# Altium schematic sheet MicrocontrollerDigital.SchDoc
size A3; SheetNumber: 2; SheetTotal: 3
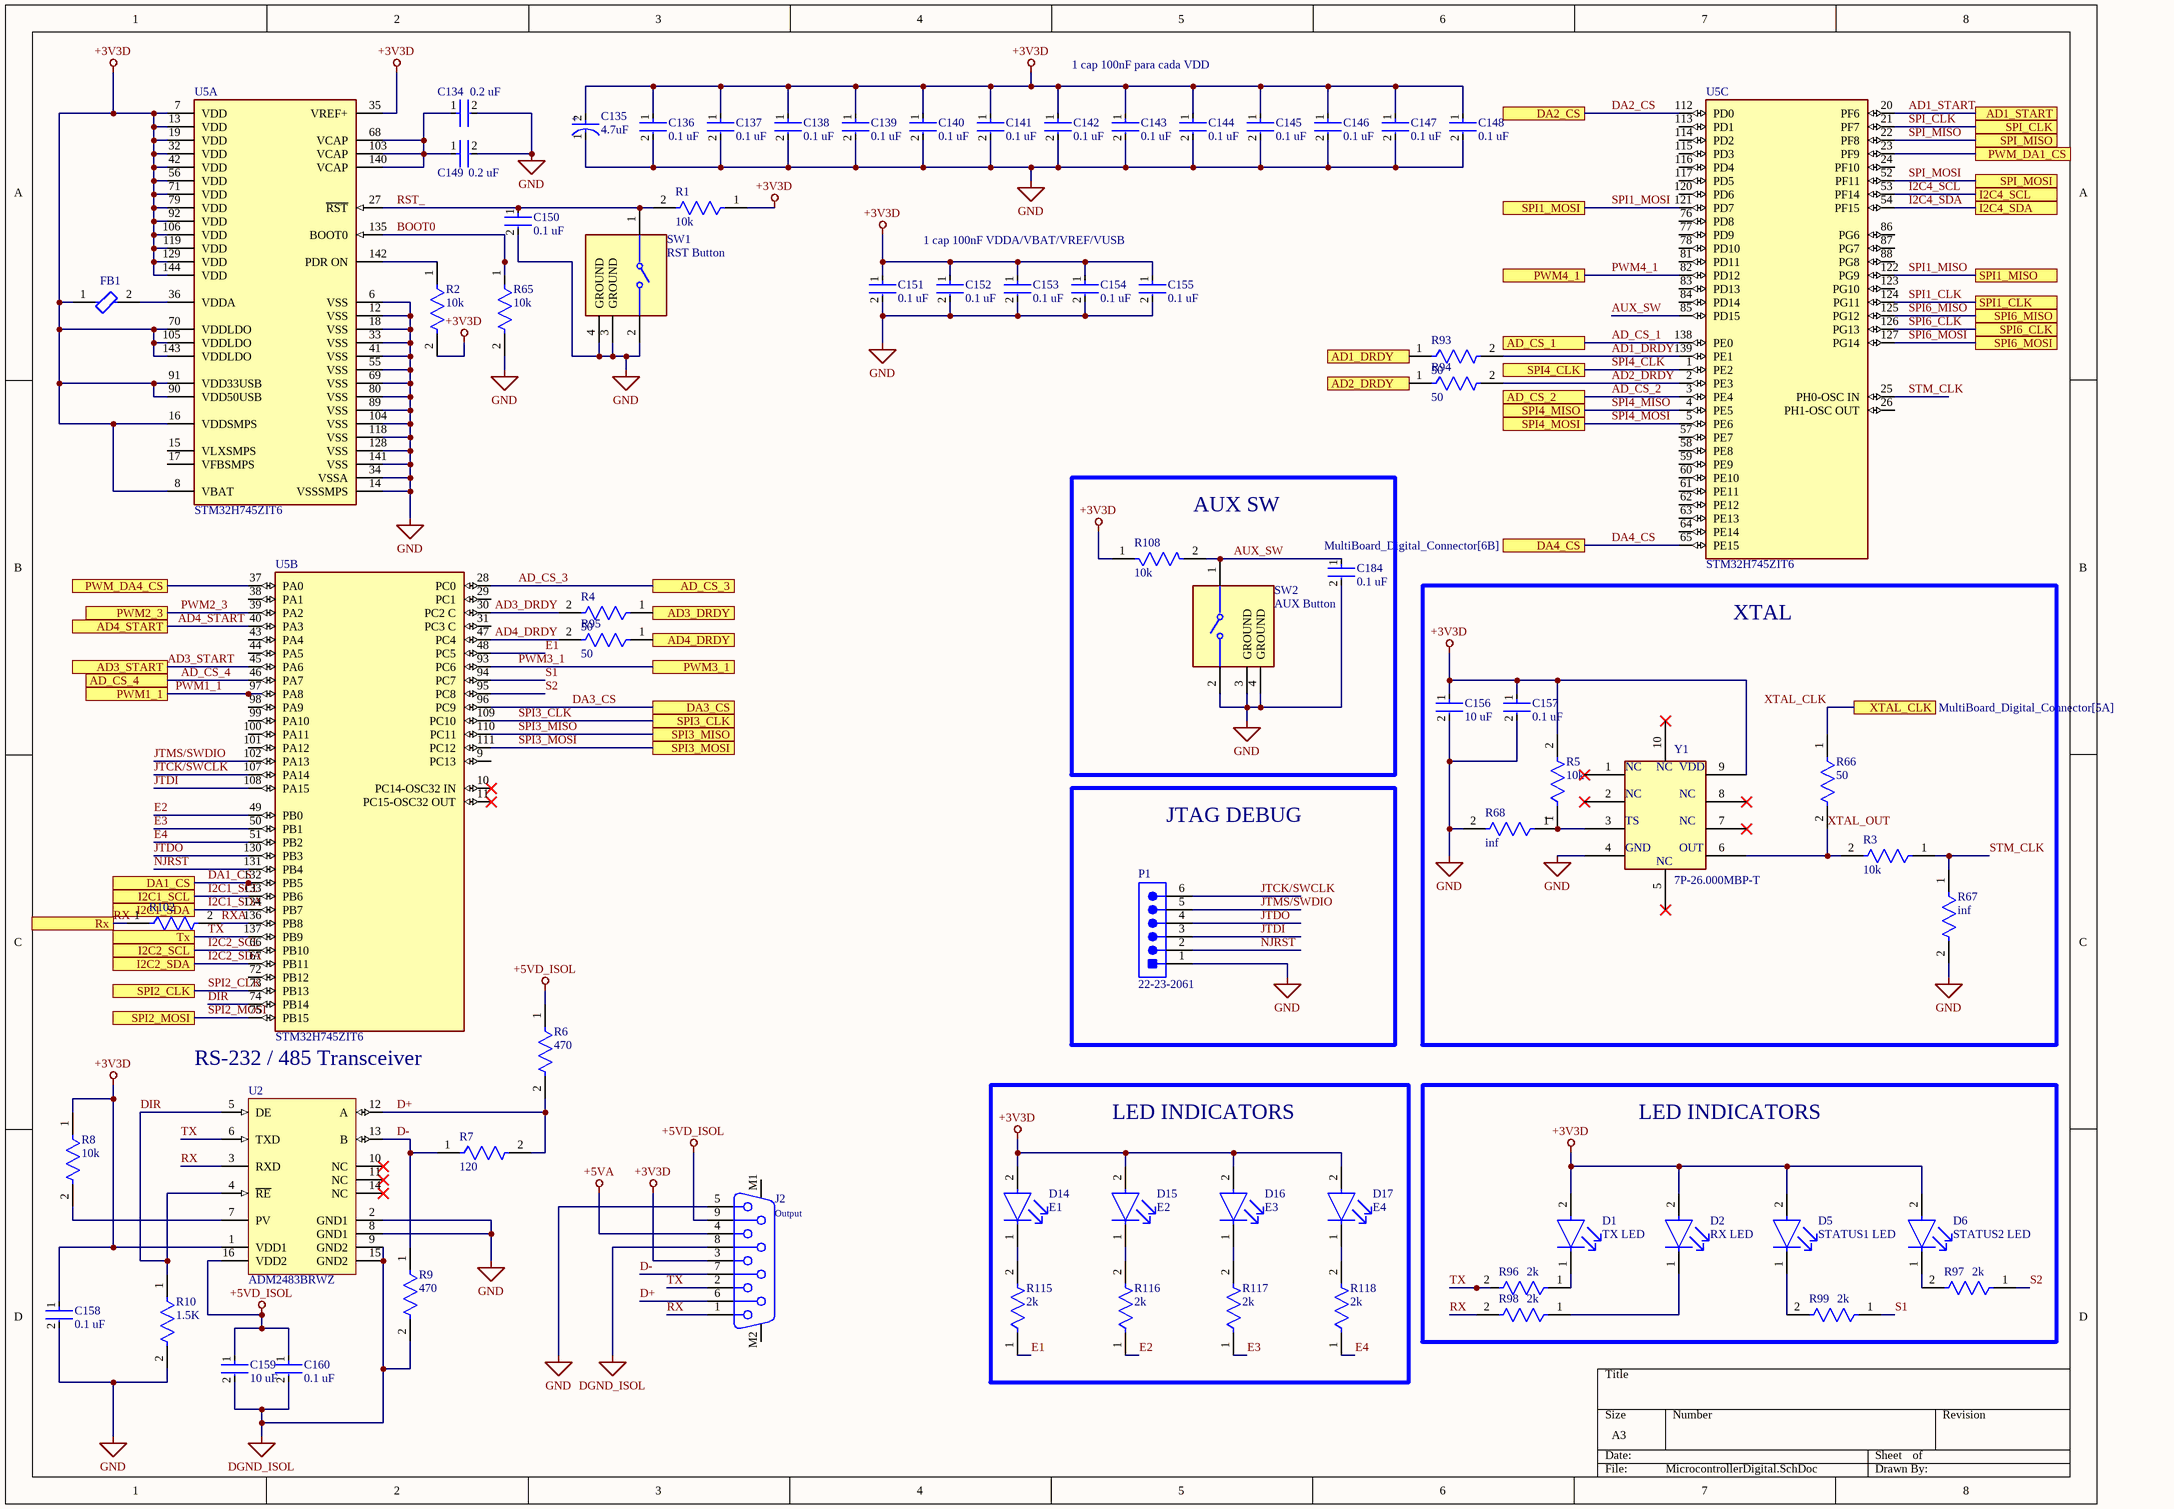
[diagram p0: MicrocontrollerDigital.SchDoc]

## Parts
C134  0.2 uF  [FP-CC0805-0_85-MFG]
C135  4.7uF  [FP-TAJR-MFG]
C136  0.1 uF  [FP-CC0805-0_85-MFG]
C137  0.1 uF  [FP-CC0805-0_85-MFG]
C138  0.1 uF  [FP-CC0805-0_85-MFG]
C139  0.1 uF  [FP-CC0805-0_85-MFG]
C140  0.1 uF  [FP-CC0805-0_85-MFG]
C141  0.1 uF  [FP-CC0805-0_85-MFG]
C142  0.1 uF  [FP-CC0805-0_85-MFG]
C143  0.1 uF  [FP-CC0805-0_85-MFG]
C144  0.1 uF  [FP-CC0805-0_85-MFG]
C145  0.1 uF  [FP-CC0805-0_85-MFG]
C146  0.1 uF  [FP-CC0805-0_85-MFG]
C147  0.1 uF  [FP-CC0805-0_85-MFG]
C148  0.1 uF  [FP-CC0805-0_85-MFG]
C149  0.2 uF  [FP-CC0805-0_85-MFG]
C150  0.1 uF  [FP-CC0805-0_85-MFG]
C151  0.1 uF  [FP-CC0805-0_85-MFG]
C152  0.1 uF  [FP-CC0805-0_85-MFG]
C153  0.1 uF  [FP-CC0805-0_85-MFG]
C154  0.1 uF  [FP-CC0805-0_85-MFG]
C155  0.1 uF  [FP-CC0805-0_85-MFG]
C156  10 uF  [FP-CC0805-0_85-MFG]
C157  0.1 uF  [FP-CC0805-0_85-MFG]
C158  0.1 uF  [FP-CC0805-0_85-MFG]
C159  10 uF  [FP-0805-L_2_01_0_2-W_1_25-MFG]
C160  0.1 uF  [FP-CC0805-0_85-MFG]
C184  0.1 uF  [FP-CC0805-0_85-MFG]
D1  TX LED  [FP-APHCM2012SYCK-F01-MFG]
D2  RX LED  [FP-APHCM2012SYCK-F01-MFG]
D5  STATUS1 LED  [FP-APHCM2012SYCK-F01-MFG]
D6  STATUS2 LED  [FP-APHCM2012SYCK-F01-MFG]
D14  E1  [FP-APHCM2012SYCK-F01-MFG]
D15  E2  [FP-APHCM2012SYCK-F01-MFG]
D16  E3  [FP-APHCM2012SYCK-F01-MFG]
D17  E4  [FP-APHCM2012SYCK-F01-MFG]
FB1  (no value)  [FP-BLM21-0_2-t0_85-e0_5-IPC_A]
J2  Output  [618009231121]
P1  22-23-2061  [MOLX-22-23-2061_V]
R1  10k  [FP-RR1220-MFG]
R2  10k  [FP-RR1220-MFG]
R3  10k  [FP-RR1220-MFG]
R4  50  [FP-RR1220-MFG]
R5  10k  [FP-RR1220-MFG]
R6  470  [FP-RR1220-MFG]
R7  120  [FP-RR1220-MFG]
R8  10k  [FP-RR1220-MFG]
R9  470  [FP-RR1220-MFG]
R10  1.5K  [FP-RR1220-MFG]
R65  10k  [FP-RR1220-MFG]
R66  50  [FP-RR1220-MFG]
R67  inf  [FP-RR1220-MFG]
R68  inf  [FP-RR1220-MFG]
R93  50  [FP-RR1220-MFG]
R94  50  [FP-RR1220-MFG]
R95  50  [FP-RR1220-MFG]
R96  2k  [FP-RR1220-MFG]
R97  2k  [FP-RR1220-MFG]
R98  2k  [FP-RR1220-MFG]
R99  2k  [FP-RR1220-MFG]
R102  10  [FP-RR1220-MFG]
R108  10k  [FP-RR1220-MFG]
R115  2k  [FP-RR1220-MFG]
R116  2k  [FP-RR1220-MFG]
R117  2k  [FP-RR1220-MFG]
R118  2k  [FP-RR1220-MFG]
SW1  RST Button  [FP-PTS636_SKG25_SMTR_LFS-MFG]
SW2  AUX Button  [FP-PTS636_SKG25_SMTR_LFS-MFG]
U2  ADM2483BRWZ  [ADI-ADM2483BRWZ-16_M]
U5  STM32H745ZIT6  [FP-LQFP144-1A-MFG]  (parts A,B,C of 3)
Y1  7P-26.000MBP-T  [7P-26.000MBP-T]

## Blocks framed on the sheet
AUX SW: C184 R108 SW2
XTAL: C156 C157 R3 R5 R66-R68 Y1
JTAG DEBUG: P1
LED INDICATORS: D14-D17 R115-R118
LED INDICATORS: D1 D2 D5 D6 R96-R99

## Ports
AD1_DRDY (see MultiBoard_Digital_Connector[6A]), AD1_START (see MultiBoard_Digital_Connector[6B]), AD2_DRDY (see MultiBoard_Digital_Connector[6A]), AD3_DRDY (see MultiBoard_Digital_Connector[6A]), AD3_START (see MultiBoard_Digital_Connector[6B]), AD4_DRDY (see MultiBoard_Digital_Connector[6B]), AD4_START (see MultiBoard_Digital_Connector[6B]), AD_CS_1 (see MultiBoard_Digital_Connector[6A]), AD_CS_2 (see MultiBoard_Digital_Connector[6A]), AD_CS_3 (see MultiBoard_Digital_Connector[6A]), AD_CS_4 (see MultiBoard_Digital_Connector[6A]), DA1_CS (see MultiBoard_Digital_Connector[6B]), DA2_CS (see MultiBoard_Digital_Connector[6B]), DA3_CS (see MultiBoard_Digital_Connector[6B]), DA4_CS (see MultiBoard_Digital_Connector[6B]), I2C1_SCL (see MultiBoard_Digital_Connector[5B]), I2C1_SDA (see MultiBoard_Digital_Connector[5B]), I2C2_SCL (see MultiBoard_Digital_Connector[5B]), I2C2_SDA (see MultiBoard_Digital_Connector[5B]), I2C4_SCL (see MultiBoard_Digital_Connector[5B]), I2C4_SDA (see MultiBoard_Digital_Connector[5B]), PWM1_1 (see MultiBoard_Digital_Connector[5A]), PWM2_3 (see MultiBoard_Digital_Connector[6B]), PWM3_1 (see MultiBoard_Digital_Connector[6B]), PWM4_1 (see MultiBoard_Digital_Connector[6B]), PWM_DA1_CS (see MultiBoard_Digital_Connector[6B]), PWM_DA4_CS (see MultiBoard_Digital_Connector[6B]), Rx (see MultiBoard_Digital_Connector[5B]), SPI1_CLK (see MultiBoard_Digital_Connector[5A]), SPI1_MISO (see MultiBoard_Digital_Connector[5A]), SPI1_MOSI (see MultiBoard_Digital_Connector[5A]), SPI2_CLK (see MultiBoard_Digital_Connector[5A]), SPI2_MOSI (see MultiBoard_Digital_Connector[5A]), SPI3_CLK (see MultiBoard_Digital_Connector[5A]), SPI3_MISO (see MultiBoard_Digital_Connector[5A]), SPI3_MOSI (see MultiBoard_Digital_Connector[5A]), SPI4_CLK (see MultiBoard_Digital_Connector[5B]), SPI4_MISO (see MultiBoard_Digital_Connector[5B]), SPI4_MOSI (see MultiBoard_Digital_Connector[5B]), SPI6_CLK (see MultiBoard_Digital_Connector[5B]), SPI6_MISO (see MultiBoard_Digital_Connector[5B]), SPI6_MOSI (see MultiBoard_Digital_Connector[5B]), SPI_CLK (see MultiBoard_Digital_Connector[5B]), SPI_MISO (see MultiBoard_Digital_Connector[5B]), SPI_MOSI (see MultiBoard_Digital_Connector[5B]), Tx (see MultiBoard_Digital_Connector[5B]), XTAL_CLK (see MultiBoard_Digital_Connector[5A])

## Nets
+3V3D: C135.2(A) C136.1 C137.1 C138.1 C139.1 C140.1 C141.1 C142.1 C143.1 C144.1 C145.1 C146.1 C147.1 C148.1 C151.1 C152.1 C153.1 C154.1 C155.1 C156.1 C157.1 C158.1 D1.2(A) D2.2(A) D5.2(A) D6.2(A) D14.2(A) D15.2(A) D16.2(A) D17.2(A) FB1.1 J2.3 R1.1 R2.2 R5.2 R8.1 R108.1 U2.1(VDD1) U5.7(VDD) U5.8(VBAT) U5.13(VDD) U5.16(VDDSMPS) U5.19(VDD) U5.32(VDD) U5.35(VREF+) U5.42(VDD) U5.56(VDD) U5.70(VDDLDO) U5.71(VDD) U5.79(VDD) U5.90(VDD50USB) U5.91(VDD33USB) U5.92(VDD) U5.105(VDDLDO) U5.106(VDD) U5.119(VDD) U5.129(VDD) U5.143(VDDLDO) U5.144(VDD) Y1.9
+5VA: J2.4
+5VD_ISOL: C159.1 C160.1 J2.9 R6.1 U2.16(VDD2)
DGND_ISOL: C159.2 C160.2 J2.8 R9.2 U2.9(GND2) U2.15(GND2)
GND: C134.2 C135.1(C) C136.2 C137.2 C138.2 C139.2 C140.2 C141.2 C142.2 C143.2 C144.2 C145.2 C146.2 C147.2 C148.2 C149.2 C150.2 C151.2 C152.2 C153.2 C154.2 C155.2 C156.2 C157.2 C158.2 C184.2 J2.5 P1.1 R10.2 R65.2 R67.2 R68.2 SW1.2 SW1.3(GROUND) SW1.4(GROUND) SW2.2 SW2.3(GROUND) SW2.4(GROUND) U2.2(GND1) U2.8(GND1) U5.6(VSS) U5.12(VSS) U5.14(VSSSMPS) U5.18(VSS) U5.33(VSS) U5.34(VSSA) U5.41(VSS) U5.55(VSS) U5.69(VSS) U5.80(VSS) U5.89(VSS) U5.104(VSS) U5.118(VSS) U5.128(VSS) U5.141(VSS) Y1.4
AD1_DRDY: R93.2 U5.139(PE1)
AD1_DRDY: R93.1 ; port AD1_DRDY  [a separate net that carries the same name]
AD1_START: U5.20(PF6) ; port AD1_START
AD2_DRDY: R94.2 U5.2(PE3)
AD2_DRDY: R94.1 ; port AD2_DRDY  [a separate net that carries the same name]
AD3_DRDY: R4.2 U5.30(PC2_C)
AD3_DRDY: R4.1 ; port AD3_DRDY  [a separate net that carries the same name]
AD3_START: U5.45(PA6) ; port AD3_START
AD4_DRDY: R95.2 U5.47(PC4)
AD4_DRDY: R95.1 ; port AD4_DRDY  [a separate net that carries the same name]
AD4_START: U5.40(PA3) ; port AD4_START
AD_CS_1: U5.138(PE0) ; port AD_CS_1
AD_CS_2: U5.3(PE4) ; port AD_CS_2
AD_CS_3: U5.28(PC0) ; port AD_CS_3
AD_CS_4: U5.46(PA7) ; port AD_CS_4
AUX_SW: C184.1 R108.2 SW2.1 U5.85(PD15)
BOOT0: R65.1 U5.135(BOOT0)
D+: J2.6 R6.2 R7.2 U2.12(A)
D-: J2.7 R7.1 R9.1 U2.13(B)
DA1_CS: U5.132(PB5) ; port DA1_CS
DA2_CS: U5.112(PD0) ; port DA2_CS
DA3_CS: U5.96(PC9) ; port DA3_CS
DA4_CS: U5.65(PE15) ; port DA4_CS
DIR: R10.1 U2.4(~{RE}) U2.5(DE) U5.74(PB14)
E1: R115.1 U5.48(PC5)
E2: R116.1 U5.49(PB0)
E3: R117.1 U5.50(PB1)
E4: R118.1 U5.51(PB2)
I2C1_SCL: U5.133(PB6) ; port I2C1_SCL
I2C1_SDA: U5.134(PB7) ; port I2C1_SDA
I2C2_SCL: U5.66(PB10) ; port I2C2_SCL
I2C2_SDA: U5.67(PB11) ; port I2C2_SDA
I2C4_SCL: U5.53(PF14) ; port I2C4_SCL
I2C4_SDA: U5.54(PF15) ; port I2C4_SDA
JTCK/SWCLK: P1.6 U5.107(PA14)
JTDI: P1.3 U5.108(PA15)
JTDO: P1.4 U5.130(PB3)
JTMS/SWDIO: P1.5 U5.102(PA13)
NJRST: P1.2 U5.131(PB4)
PWM1_1: U5.97(PA8) ; port PWM1_1
PWM2_3: U5.39(PA2) ; port PWM2_3
PWM3_1: U5.93(PC6) ; port PWM3_1
PWM4_1: U5.82(PD12) ; port PWM4_1
PWM_DA1_CS: U5.23(PF9) ; port PWM_DA1_CS
PWM_DA4_CS: U5.37(PA0) ; port PWM_DA4_CS
RST_: C150.1 R1.2 SW1.1 U5.27(~{RST})
RX: J2.1 R98.2 R102.1 U2.3(RXD) ; port Rx
RXA: R102.2 U5.136(PB8)
S1: R99.1 U5.94(PC7)
S2: R97.1 U5.95(PC8)
SPI1_CLK: U5.124(PG11) ; port SPI1_CLK
SPI1_MISO: U5.122(PG9) ; port SPI1_MISO
SPI1_MOSI: U5.121(PD7) ; port SPI1_MOSI
SPI2_CLK: U5.73(PB13) ; port SPI2_CLK
SPI2_MOSI: U5.75(PB15) ; port SPI2_MOSI
SPI3_CLK: U5.109(PC10) ; port SPI3_CLK
SPI3_MISO: U5.110(PC11) ; port SPI3_MISO
SPI3_MOSI: U5.111(PC12) ; port SPI3_MOSI
SPI4_CLK: U5.1(PE2) ; port SPI4_CLK
SPI4_MISO: U5.4(PE5) ; port SPI4_MISO
SPI4_MOSI: U5.5(PE6) ; port SPI4_MOSI
SPI6_CLK: U5.126(PG13) ; port SPI6_CLK
SPI6_MISO: U5.125(PG12) ; port SPI6_MISO
SPI6_MOSI: U5.127(PG14) ; port SPI6_MOSI
SPI_CLK: U5.21(PF7) ; port SPI_CLK
SPI_MISO: U5.22(PF8) ; port SPI_MISO
SPI_MOSI: U5.52(PF11) ; port SPI_MOSI
STM_CLK: R3.1 R67.1 U5.25(PH0-OSC_IN)
TX: J2.2 R96.2 U2.6(TXD) U5.137(PB9) ; port Tx
XTAL_CLK: R66.1 ; port XTAL_CLK
XTAL_OUT: R3.2 R66.2 Y1.6
NetC134_1: C134.1 C149.1 U5.68(VCAP) U5.103(VCAP) U5.140(VCAP)
NetD1_1: D1.1(C) R96.1
NetD2_1: D2.1(C) R98.1
NetD5_1: D5.1(C) R99.2
NetD6_1: D6.1(C) R97.2
NetD14_1: D14.1(C) R115.2
NetD15_1: D15.1(C) R116.2
NetD16_1: D16.1(C) R117.2
NetD17_1: D17.1(C) R118.2
NetFB1_2: FB1.2 U5.36(VDDA)
NetR2_1: R2.1 U5.142(PDR_ON)
NetR5_1: R5.1 R68.1 Y1.3
NetR8_2: R8.2 U2.7(PV)

Not connected (* = marked no-connect by the designer): J2 M1 M2; U2 10(NC)* 11(NC)* 14(NC)*; U5 9(PC13) 10(PC14-OSC32_IN)* 11(PC15-OSC32_OUT)* 15(VLXSMPS) 17(VFBSMPS) 24(PF10) 26(PH1-OSC_OUT) 29(PC1) 31(PC3_C) 38(PA1) 43(PA4) 44(PA5) 57(PE7) 58(PE8) 59(PE9) 60(PE10) 61(PE11) 62(PE12) 63(PE13) 64(PE14) 72(PB12) 76(PD8) 77(PD9) 78(PD10) 81(PD11) 83(PD13) 84(PD14) 86(PG6) 87(PG7) 88(PG8) 98(PA9) 99(PA10) 100(PA11) 101(PA12) 113(PD1) 114(PD2) 115(PD3) 116(PD4) 117(PD5) 120(PD6) 123(PG10); Y1 1(_)* 2* 5* 7* 8* 10*

## Notes on the sheet
- 1 cap 100nF para cada VDD
- 1 cap 100nF VDDA/VBAT/VREF/VUSB
- RS-232 / 485 Transceiver
- (in symbol 7P-26.000MBP-T) NC; VDD; TS; GND; OUT
- (in symbol CMP-2007-04030-2) +

## Library data of the parts
C134 C136-C158 C160 C184 = CMP-1036-04410-2: CAP CER 0.1UF 25V X7R 0805; Manufacturer Part Number: CC0805KRX7R8BB104; Manufacturer: Yageo; Tolerance: 0.1; Material: Ceramic; Value: 100 nF; ComponentLink2URL: http://www.yageo.com/documents/recent/UPY-GPHC_Y5V_6.3V-to-50V_8.pdf; Category: Cap; Mouser Description: Multilayer Ceramic Capacitors MLCC - SMD/SMT 100nF 25V X7R 10%; Device Class L1: Passive Components; Footprint Url: http://www.yageo.com/exep/pages/download/literatures/UPY-C_GEN_24.pdf; Height: 0.95mm; Digikey Description: CAP CER 0.1UF 25V X7R 0805; Lead Free: Yes; Temperature Range High: +85°C; Temperature: -30°C to +85°C; Ipc Land Pattern Name: CAPC200125X85; Capacitance: 100 nF; Automotive: No; Octopart: https://octopart.com/cc0805krx7r8bb104-yageo-39467766; Device Class L2: Capacitors; Temperature Characteristic: X7R; Voltage Rating: 25 V; ComponentLink2Description: Datasheet; Temperature Range Low: -30°C; Device Class L3: Ceramic Capacitors; RoHS: TRUE; Package: CC0805-0.85
C135 = CMP-2007-04030-2: 4.7uF 10V  ±10% 9Ω 0805  SMD Tantalum Capacitor; Dissipation Factor: 6%; ESR (Equivalent Series Resistance): 9R; Leakage Current: 500nA; Polarity: Polar; Lead Free: Lead Free; Min Operating Temperature: -55°C; Width: 1.3mm; Depth: 1.3mm; Case Code (Metric): 2012; Features: General Purpose; Length: 2.05mm; Package Quantity: 1; Tolerance: 10%; Height - Seated (Max): 0.047inch; REACH SVHC: No SVHC; Termination: SMD/SMT; Max Operating Temperature: 125°C; Mount: Surface Mount; Case/Package: 0805; Packaging: Tape and Reel; Case Code (Imperial): 0805; Voltage: 10V; Dielectric Material: Tantalum; Weight: 0.000194oz; Construction: Flat; Series: TAJ; Radiation Hardening: No; Voltage Rating: 10V; Height: 1.2mm; Capacitance: 4.7uF; RoHS Compliant: Yes
C159 = CMP-2007-04521-2: General Purpose Ceramic Capacitor, 0805, 10uF, 10%, X5R, 15%, 10V; Packaging: Tape and Reel; Mount: Surface Mount; Length: 2.01mm; Series: -; Dielectric Material: Ceramic; Voltage Rating: 10V; Tolerance: 10%; Voltage Rating (DC): 10V; Termination: SMD/SMT; Number of Pins: 2; Thickness: 0.055inch; Min Operating Temperature: -55°C; REACH SVHC: No SVHC; Width: 0.049inch; Case/Package: 0805; Capacitance: 10uF; Depth: 1.25mm; Height: 1.4mm; Voltage: 10V; Package Quantity: 3000; Lead Free: Lead Free; Case Code (Metric): 2012; Construction: Flat; RoHS Compliant: Yes; Case Code (Imperial): 0805; Dielectric: X5R; Max Operating Temperature: 85°C; Radiation Hardening: No
D1 D2 D5 D6 D14-D17 = CMP-44529-000064-1: LED YELLOW CLEAR CHIP SMD; Number of LEDs: 1; Luminous Intensity: 150mcd; Dominant Wavelength: 590nm; Test Current: 20mA; Illumination Color: Green; Forward Voltage: 2V; Viewing Angle: 110°; Number of Pins: 2; Packaging: Tape and Reel; Width: 1.25mm; Height: 0.4mm; Lens Color: Clear; RoHS Compliant: Yes; Lead Free: Lead Free; Min Operating Temperature: -40°C; Case Code (Imperial): 0805; Case/Package: 0805; Series: APHCM; Wavelength: 590nm; Max Operating Temperature: 85°C; Length: 2mm; Color: Yellow; Package Quantity: 2000; Mount: Surface Mount; Lens Style: Clear; Forward Current: 20mA; Case Code (Metric): 2012
FB1 = CMP-0686-00680-3: Chip Ferrite Bead, 0805, 1800Ω @ 100MHz, 0.5Ω, 25%, 250mA; Material: Steel; Resistance: 500mR; Impedance: 1.8kR; Number of Lines: 1; Shielding: Unshielded; Max DC Current: 200mA; Termination: SMD/SMT; Frequency: 100MHz; Depth: 1.45mm; RoHS Compliant: Yes; Lead Free: Lead Free; Packaging: Tape and Reel; Min Operating Temperature: -55°C; Test Frequency: 100MHz; REACH SVHC: No SVHC; DC Resistance (DCR): 500mR; Case Code (Metric): 2012; Case/Package: 0805; Number of Pins: 2; Max Current Rating: 250mA; Width: 1.25mm; Package Quantity: 1; Number of Circuits: 1; Tolerance: 25%; DC Resistance-Max: 500mR; Length: 2mm; Current Rating: 200mA; Case Code (Imperial): 0805; Max Operating Temperature: 125°C; Core Material: Ferrite; Height: 0.041inch; Series: BLM21B
J2 = CMP-1502-00200-1: Female PCB Connector with Hex Screw WR-DSUB, 8.08 mm, Angled, 9 pins; Manufacturer: Wurth Elektronik; Contact Resistance: 30mOhm; Pin Number: 9; Working Voltage: 125VAC; Rated Current: 3A; Gender: Female; Datasheet URL: https://katalog.we-online.de/em/datasheet/6180xx231121.pdf; Packaging: Tray; Package Reference: 618009231121; Operating Temperature: -40to85degC; Manufacturer URL: http://www.we-online.de; Publisher: WurthElektronik; Mounting Technology: THT; Part Number: 618009231121; Orientation: Angled
P1 = CMP-2000-05536-1: Male Header, Pitch 2.54 mm, 1 x 6 Position, Height 10.67 mm, Tail Length 3.56 mm, 0 to 70 degC, RoHS, Bulk; Manufacturer: Molex; Pitch: 2.54mm; Mounting Angle: Vertical; Current Rating: 4A; Number of Positions / Contacts: 6; Voltage Rating: 250V; Packaging: Bulk; Package Description: Male Header, Pitch 2.54 mm, 1 x 6 Position, Height 10.67 mm, Tail Length 3.56 mm; Number of Rows: 1; Type: PinStrip; Contact Material: Brass; Product Category: .100K.K.Connectors; Factory Pack Quantity: 1000; Mounting Style: ThroughHole; RoHS: Details; Contact Plating: Tin; Housing Material: Nylon; Mounting Technology: ThroughHole; Termination Style: ThroughHole; Tradename: KK; Number of Positions: 6; Brand: Molex; Product Type: Headers; Series: 6373; Datasheet URL: https://datasheet.ciiva.com/19460/232303-19460895.pdf; Package Reference: 22-23-2061; Datasheet Version: Rev. P, 09/2001; Manufacturer URL: http://www.molex.com/
R1-R10 R65-R68 R93-R99 R102 R108 R115-R118 = CMP-2001-03560-2: 49.9Ω ±0.5% 0.1W 1/10W Chip Resistor 0805 (2012 Metric) Thin Film; Voltage Rating: 100V; Temperature Coefficient: 50ppm/°C; Max Power Dissipation: 100mW; Resistance: 49.9R; Packaging: Tape and Reel; Length: 0.079inch; Termination: SMD/SMT; Case Code (Metric): 2012; Voltage Rating (DC): 100V; Height: 0.02inch; Width: 0.049inch; RoHS Compliant: Yes; Tolerance: 0.5%; Case/Package: 0805; Resistance Tolerance: 0.5%; Lead Free: Lead Free; Size Code: 0805; Min Operating Temperature: -55°C; Max Operating Temperature: 125°C; Case Code (Imperial): 0805; Package Quantity: 1; Resistor Type: Thin Film; Number of Terminations: 2; Power Rating: 100mW; Series: RR
SW1 SW2 = CMP-10040-000025-1: TACT 6.0 X 3.5, 2.5 MM H, 250GF,
U2 = CMP-2000-05041-1: Half-Duplex, iCoupler(R) Isolated RS-485 Transceiver , 500 Kbps , -40 to 85 degC, 16-Pin SOIC (RW-16), RoHS, Tube; Manufacturer: Analog Devices; Number of Transceivers: 1; Receiver Signal Type: Differential; Single Supply Voltage (Typ): NotRequiredV; DELETED: Compliant; Data Rate: 0.5kbps; Rad Hardened: No; Dual Supply Voltage (Typ): 3.3/5V; Interface Circuit Standard 1: EIA/TIA-485-A/RS-485; Power Supply Requirement: Dual; Dual Supply Voltage (Max): 5.25/5.5V; Dual Supply Voltage (Min): 2.7/4.75V; Data Transmission Topology: Multipoint; Supply Current: 2.5mA; Pin Count: 16; Mounting: SurfaceMount; Operating Temperature Classification: Industrial; Number of Receivers: 1; Package Type: SOICW; Single Supply Voltage (Max): NotRequiredV; Operating Temp Range: -40Cto85C; Single Supply Voltage (Min): NotRequiredV; Datasheet Version: Rev. B, 03/2005; Number of Transmitters: 1; Transmitter Signal Type: Differential; Packaging: Rail/Tube; Manufacturer URL: http://www.analog.com/; Datasheet URL: https://datasheet.ciiva.com/19456/2169766-19456772.pdf
U5 = CMP-12105-000054-1: HIGH-PERFORMANCE AND DSP WITH DP; Manufacturer: STMicroelectronics; Number Of Timers/Counters: 20; Min Supply Voltage: 1.62V; Frequency: 480MHz; Number Of I2C Channels: 4; Memory Type: FLASH; Number Of I/Os: 97; Number Of Pwm Channels: 42; Number Of Usb Channels: 2; Ram Size: 1MBytes; Memory Size: 2MBytes; Data Bus Width: 32bits; Number Of Adc Channels: 23; Number Of Ethernet Channels: 1; Number Of Uart Channels: 9; Interface: I2C,SPI,UART,USART,CAN,USB,LIN,IrDA,Ethernet,I2S,Other; Number Of A/D Converters: 3; Max Junction Temp: +125°C; Max Supply Voltage: 3.6V; Core Architecture: ARM Cortex-M4, Cortex-M7; Number Of Spi Channels: 6; Standoff Height: 0.05mm; Ambient Temperature Range Low: -40°C; Lead Free: Yes; Manufacturer Part Number: STM32H745ZIT6; Automotive: No; Height: 1.6mm; Device Class L1: Integrated Circuits (ICs); Ambient Temperature Range High: +85°C; RoHS: TRUE; Temperature Range High: +125°C; Temperature: -40°C to +125°C; Category: IC; Device Class L2: Embedded Processors and Controllers; Number Of Cores: 2; Temperature Range Low: -40°C; Octopart: https://octopart.com/stm32h745zit6-stmicroelectronics-100293939; Digikey Description: HIGH-PERFORMANCE AND DSP WITH DP; Package: LQFP144-1A; Device Class L3: Microcontrollers; ComponentLink2URL: https://www.st.com/resource/en/datasheet/stm32h745zi.pdf; ComponentLink2Description: Datasheet